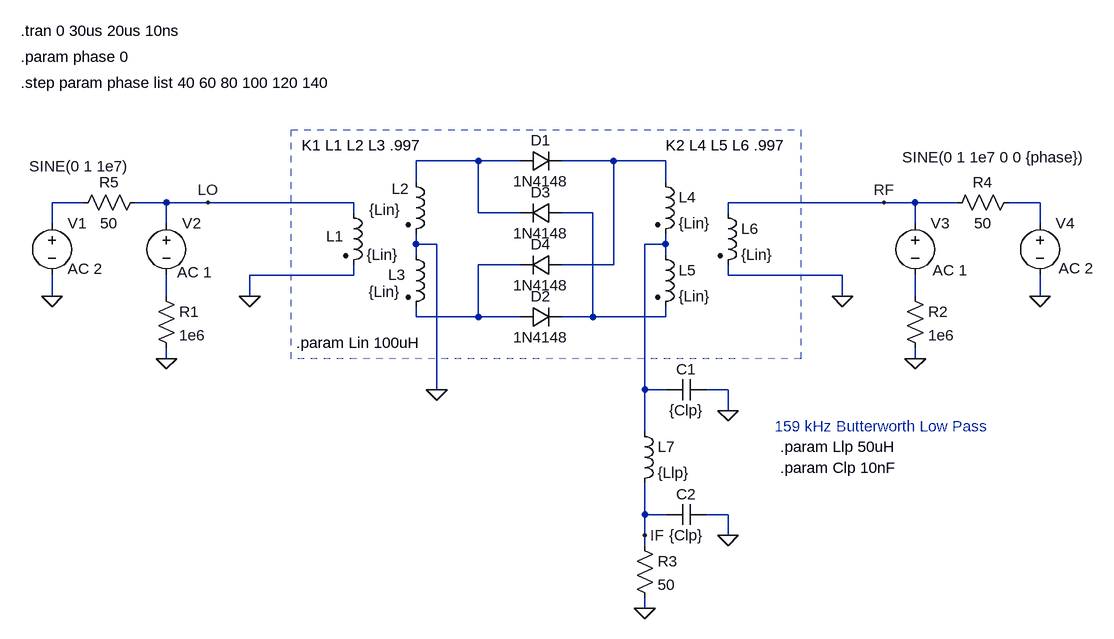
[diagram p0: schematic dioderingmixer.asc]
dioderingmixer.asc, the LTspice schematic file:
Version 4
SHEET 1 1720 788
WIRE 512 16 416 16
WIRE 576 16 512 16
WIRE 720 16 640 16
WIRE 800 16 720 16
WIRE 416 48 416 16
WIRE 800 48 800 16
WIRE -96 80 -144 80
WIRE 32 80 -16 80
WIRE 96 80 32 80
WIRE 320 80 96 80
WIRE 1136 80 896 80
WIRE 1184 80 1136 80
WIRE 1248 80 1184 80
WIRE 1376 80 1328 80
WIRE 320 96 320 80
WIRE 512 96 512 16
WIRE 576 96 512 96
WIRE 688 96 640 96
WIRE 896 96 896 80
WIRE -144 112 -144 80
WIRE 32 112 32 80
WIRE 1184 112 1184 80
WIRE 1376 112 1376 80
WIRE 416 144 416 128
WIRE 448 144 416 144
WIRE 800 144 800 128
WIRE 800 144 768 144
WIRE 416 160 416 144
WIRE 800 160 800 144
WIRE 576 176 512 176
WIRE 720 176 720 16
WIRE 720 176 640 176
WIRE 320 192 320 176
WIRE 320 192 160 192
WIRE 896 192 896 176
WIRE 1072 192 896 192
WIRE -144 224 -144 192
WIRE 32 224 32 192
WIRE 160 224 160 192
WIRE 1072 224 1072 192
WIRE 1184 224 1184 192
WIRE 1376 224 1376 192
WIRE 416 256 416 240
WIRE 512 256 512 176
WIRE 512 256 416 256
WIRE 576 256 512 256
WIRE 688 256 688 96
WIRE 688 256 640 256
WIRE 800 256 800 240
WIRE 800 256 688 256
WIRE 32 320 32 304
WIRE 1184 320 1184 304
WIRE 448 368 448 144
WIRE 768 368 768 144
WIRE 800 368 768 368
WIRE 896 368 864 368
WIRE 896 400 896 368
WIRE 768 432 768 368
WIRE 768 560 768 512
WIRE 800 560 768 560
WIRE 896 560 864 560
WIRE 768 592 768 560
WIRE 896 592 896 560
WIRE 768 608 768 592
WIRE 768 704 768 688
FLAG -144 224 0
FLAG 32 320 0
FLAG 160 224 0
FLAG 448 368 0
FLAG 1072 224 0
FLAG 1184 320 0
FLAG 1376 224 0
FLAG 896 400 0
FLAG 896 592 0
FLAG 768 704 0
FLAG 96 80 LO
FLAG 768 592 IF
FLAG 1136 80 RF
SYMBOL voltage -144 96 R0
WINDOW 3 -35 -72 Left 2
WINDOW 123 24 86 Left 2
WINDOW 39 0 0 Left 0
SYMATTR InstName V1
SYMATTR Value SINE(0 1 1e7)
SYMATTR Value2 AC 2
SYMBOL voltage 32 96 R0
WINDOW 123 17 91 Left 2
WINDOW 39 0 0 Left 0
SYMATTR InstName V2
SYMATTR Value ""
SYMATTR Value2 AC 1
SYMBOL voltage 1184 96 R0
WINDOW 123 27 88 Left 2
WINDOW 39 0 0 Left 0
SYMATTR InstName V3
SYMATTR Value ""
SYMATTR Value2 AC 1
SYMBOL voltage 1376 96 R0
WINDOW 3 -212 -86 Left 2
WINDOW 123 29 85 Left 2
WINDOW 39 0 0 Left 0
SYMATTR InstName V4
SYMATTR Value SINE(0 1 1e7 0 0 {phase})
SYMATTR Value2 AC 2
SYMBOL ind2 304 80 R0
WINDOW 0 -26 52 Left 2
SYMATTR InstName L1
SYMATTR Value {Lin}
SYMATTR Type ind
SYMBOL ind2 400 32 R0
WINDOW 0 -21 27 Left 2
WINDOW 3 -56 59 Left 2
SYMATTR InstName L2
SYMATTR Value {Lin}
SYMATTR Type ind
SYMBOL ind2 400 144 R0
WINDOW 0 -27 47 Left 2
WINDOW 3 -57 73 Left 2
SYMATTR InstName L3
SYMATTR Value {Lin}
SYMATTR Type ind
SYMBOL ind2 784 32 R0
SYMATTR InstName L4
SYMATTR Value {Lin}
SYMATTR Type ind
SYMBOL ind2 784 144 R0
SYMATTR InstName L5
SYMATTR Value {Lin}
SYMATTR Type ind
SYMBOL ind2 880 80 R0
SYMATTR InstName L6
SYMATTR Value {Lin}
SYMATTR Type ind
SYMBOL res 16 208 R0
SYMATTR InstName R1
SYMATTR Value 1e6
SYMBOL res 1168 208 R0
SYMATTR InstName R2
SYMATTR Value 1e6
SYMBOL res 752 592 R0
SYMATTR InstName R3
SYMATTR Value 50
SYMBOL diode 640 80 R90
WINDOW 0 0 32 VBottom 2
WINDOW 3 32 32 VTop 2
SYMATTR InstName D3
SYMATTR Value 1N4148
SYMBOL diode 640 160 R90
WINDOW 0 0 32 VBottom 2
WINDOW 3 32 32 VTop 2
SYMATTR InstName D4
SYMATTR Value 1N4148
SYMBOL diode 576 32 R270
WINDOW 0 32 32 VTop 2
WINDOW 3 0 32 VBottom 2
SYMATTR InstName D1
SYMATTR Value 1N4148
SYMBOL diode 576 272 R270
WINDOW 0 32 32 VTop 2
WINDOW 3 0 32 VBottom 2
SYMATTR InstName D2
SYMATTR Value 1N4148
SYMBOL cap 864 352 R90
WINDOW 0 0 32 VBottom 2
WINDOW 3 32 32 VTop 2
SYMATTR InstName C1
SYMATTR Value {Clp}
SYMBOL cap 864 544 R90
WINDOW 0 0 32 VBottom 2
WINDOW 3 32 32 VTop 2
SYMATTR InstName C2
SYMATTR Value {Clp}
SYMBOL ind 752 416 R0
SYMATTR InstName L7
SYMATTR Value {Llp}
SYMBOL res 1344 64 R90
WINDOW 0 0 56 VBottom 2
WINDOW 3 32 56 VTop 2
SYMATTR InstName R4
SYMATTR Value 50
SYMBOL res 0 64 R90
WINDOW 0 0 56 VBottom 2
WINDOW 3 32 56 VTop 2
SYMATTR InstName R5
SYMATTR Value 50
TEXT 240 -8 Left 2 !K1 L1 L2 L3 .997
TEXT 800 -8 Left 2 !K2 L4 L5 L6 .997
TEXT 232 296 Left 2 !.param Lin 100uH
TEXT 968 424 Left 2 ;159 kHz Butterworth Low Pass
TEXT 976 456 Left 2 !.param Llp 50uH
TEXT 976 488 Left 2 !.param Clp 10nF
TEXT -192 -184 Left 2 !.tran 0 30us 20us 10ns
TEXT -192 -144 Left 2 !.param phase 0
TEXT -192 -104 Left 2 !.step param phase list 40 60 80 100 120 140
RECTANGLE Normal 1008 320 224 -32 2

The netlist it stands for:
* dioderingmixer.asc
V1 N003 0 SINE(0 1 1e7) AC 2
V2 LO N008 AC 1
V3 RF N009 AC 1
V4 N004 0 SINE(0 1 1e7 0 0 {phase}) AC 2
L1 LO 0 {Lin}
L2 N001 0 {Lin}
L3 0 N007 {Lin}
L4 N002 N006 {Lin}
L5 N006 N005 {Lin}
L6 RF 0 {Lin}
R1 N008 0 1e6
R2 N009 0 1e6
R3 IF 0 50
D3 N005 N001 1N4148
D4 N002 N007 1N4148
D1 N001 N002 1N4148
D2 N007 N005 1N4148
C1 0 N006 {Clp}
C2 0 IF {Clp}
L7 N006 IF {Llp}
R4 N004 RF 50
R5 LO N003 50
.model D D
.lib standard.dio
K1 L1 L2 L3 .997
K2 L4 L5 L6 .997
.param Lin 100uH
* 159 kHz Butterworth Low Pass
.param Llp 50uH
.param Clp 10nF
.tran 0 30us 20us 10ns
.param phase 0
.step param phase list 40 60 80 100 120 140
.backanno
.end